# Altium schematic sheet Размеры платы.schdoc
size 420 x 297 mm; Author: ГН; Децимальный номер: СФ МЭИ ПЭ2-18 11.03.04. 3; Наименование. Строка 2: Плата печатная; Разработал: Гончаренко В.Ю.; Проверил: Смолин В.А.; Технический контроль: Рассказа Д.С.; Масштаб: 1:1; Лист. Номер: 1; Лист. Всего: 1
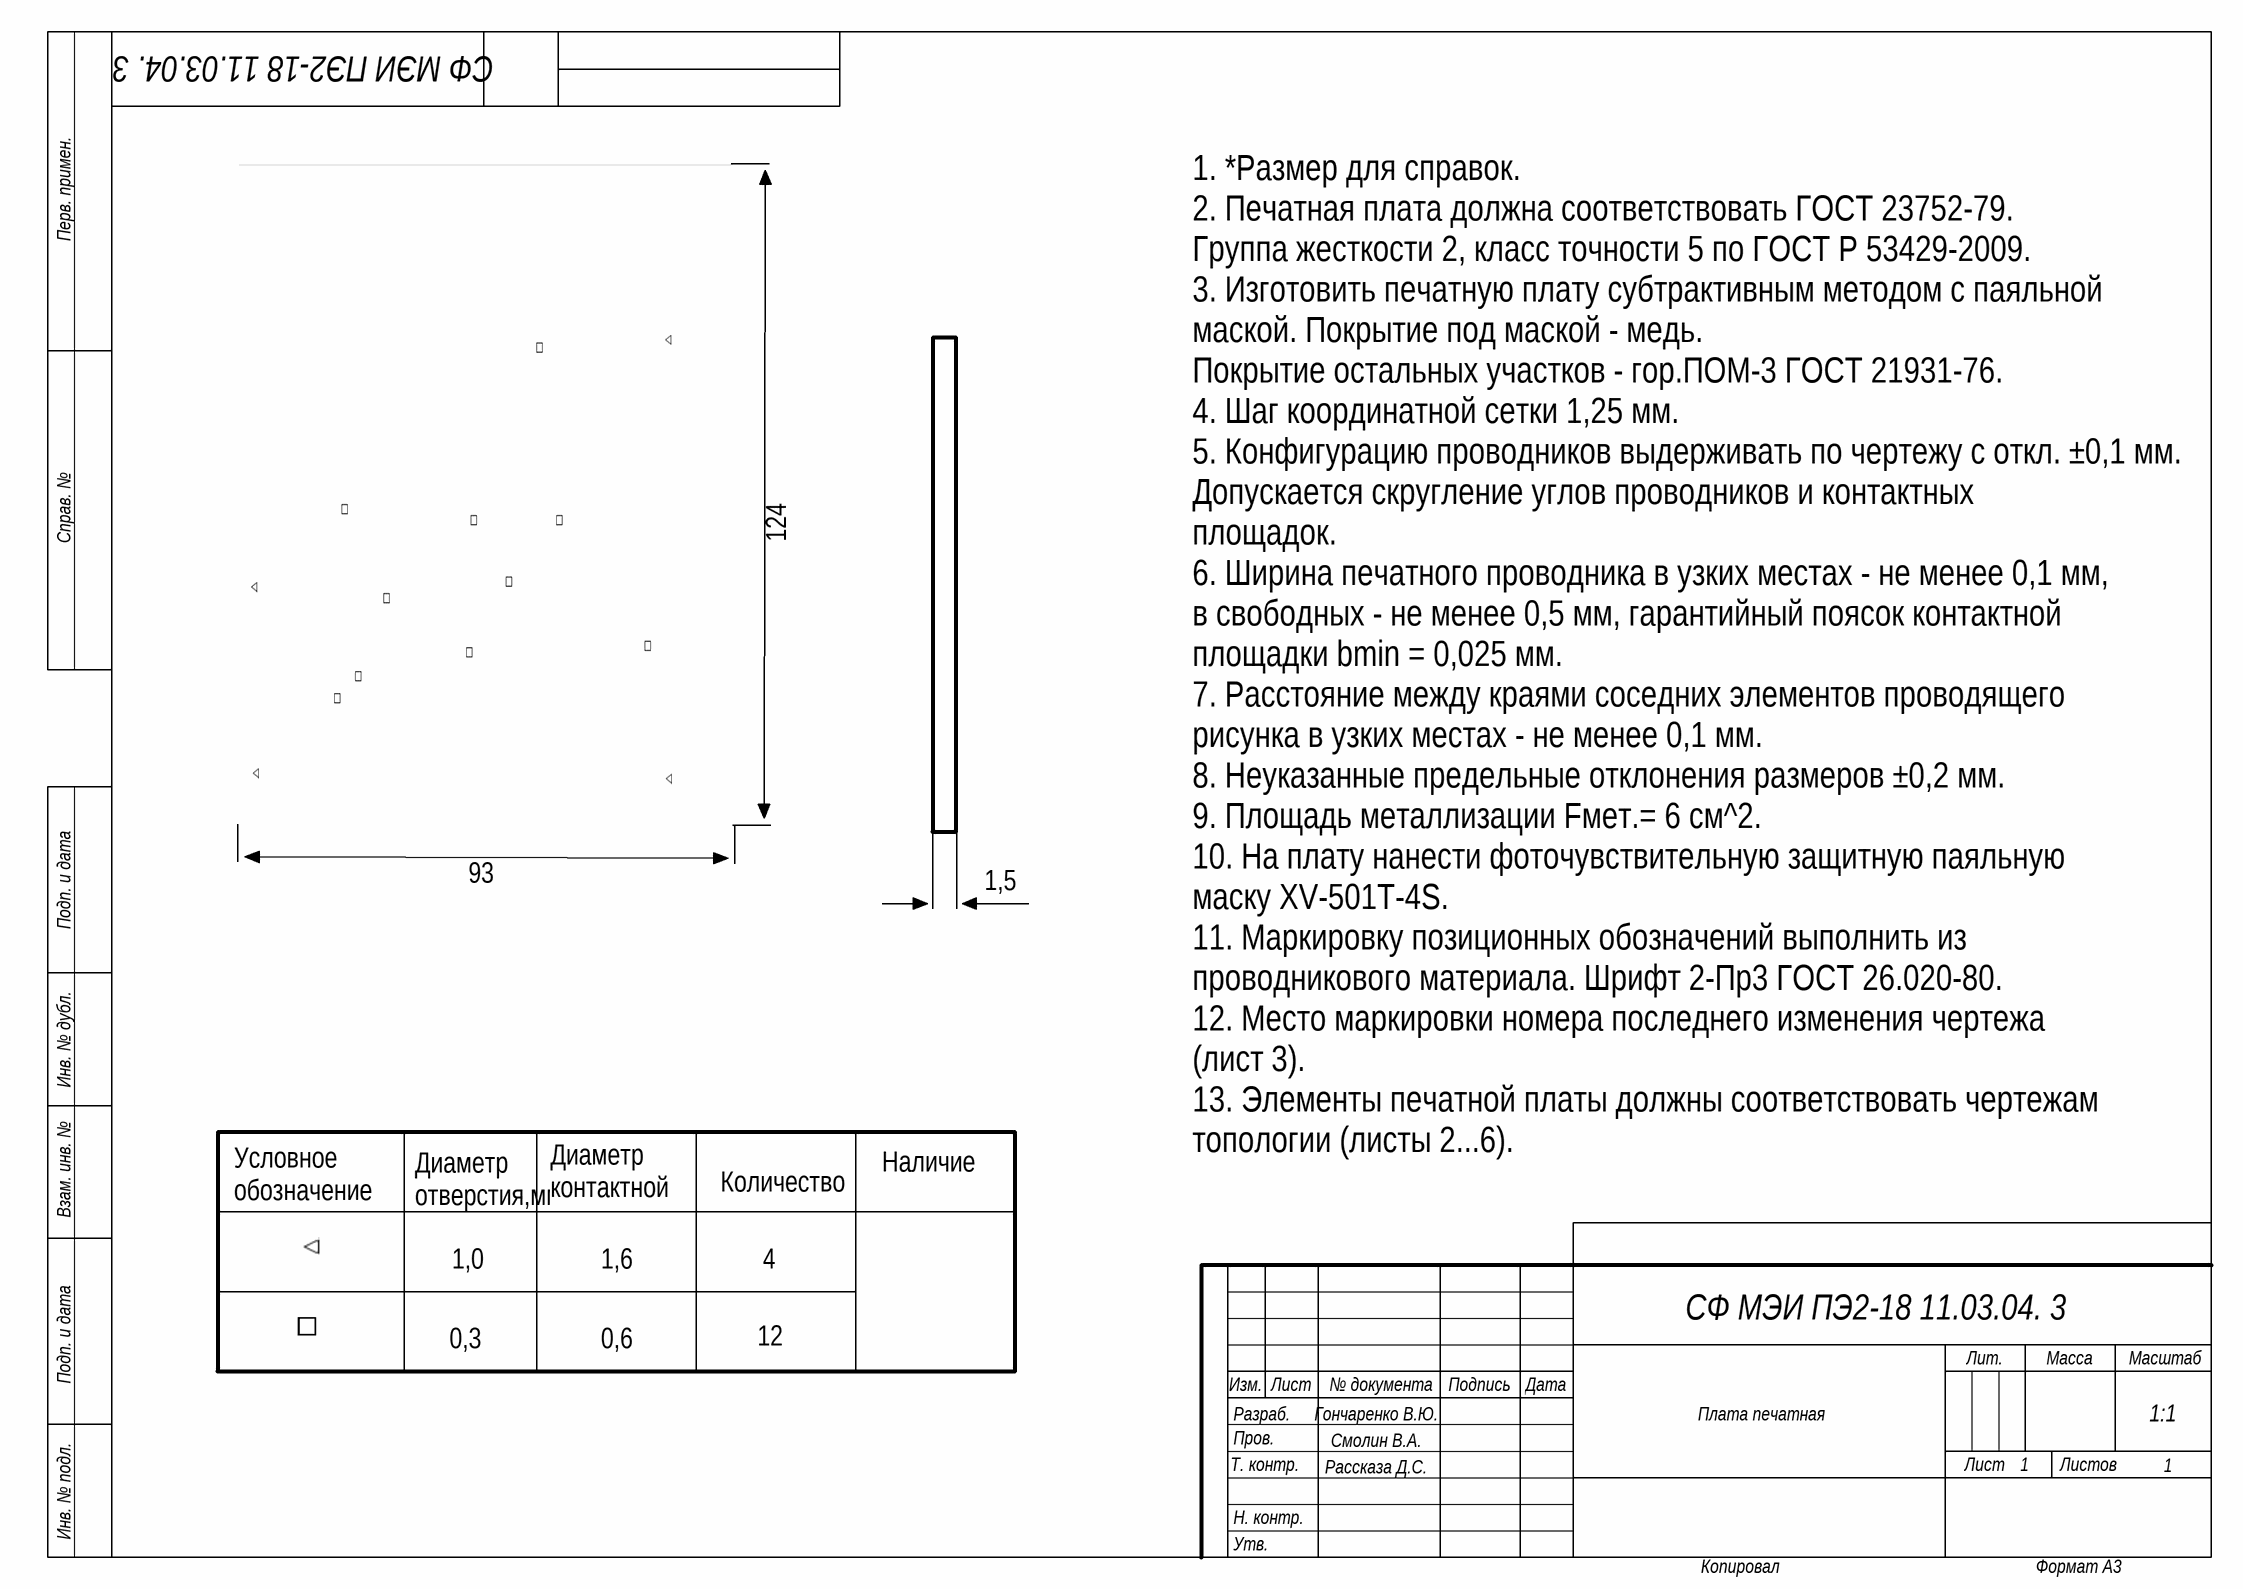
[diagram p0: Размеры платы.schdoc]

## Notes on the sheet
- 124
- 93
- 1,5
- Условное
  обозначение
  отверстия
- Диаметр
  отверстия,мм
- Диаметр
  контактной
  площадки,мм
- Количество
- Наличие
  металлизации
- 1. *Размер для справок.
  2. Печатная плата должна соответствовать ГОСТ 23752-79.
  Группа жесткости 2, класс точности 5 по ГОСТ Р 53429-2009.
  3. Изготовить печатную плату субтрактивным методом с паяльной
  маской. Покрытие под маской - медь.
  Покрытие остальных участков - гор.ПОМ-3 ГОСТ 21931-76.
  4. Шаг координатной сетки 1,25 мм.
  5. Конфигурацию проводников выдерживать по чертежу с откл. ±0,1 мм.
  Допускается скругление углов проводников и контактных
  площадок.
  6. Ширина печатного проводника в узких местах - не менее 0,1 мм,
  в свободных - не менее 0,5 мм, гарантийный поясок контактной
  площадки bmin = 0,025 мм.
  7. Расстояние между краями соседних элементов проводящего
  рисунка в узких местах - не менее 0,1 мм.
  8. Неуказанные предельные отклонения размеров ±0,2 мм.
  9. Площадь металлизации Fмет.= 6 см^2.
  10. На плату нанести фоточувствительную защитную паяльную
  маску XV-501T-4S.
  11. Маркировку позиционных обозначений выполнить из
  проводникового материала. Шрифт 2-Пр3 ГОСТ 26.020-80.
  12. Место маркировки номера последнего изменения чертежа
  (лист 3).
  13. Элементы печатной платы должны соответствовать чертежам
  топологии (листы 2...6).
- 1,0
- 1,6
- 4
- Есть
- 0,3
- 0,6
- 12
- Перв. примен.
- Справ. №
- Подп. и дата
- Инв. № дубл.
- Взам. инв. №
- Разраб.
- Изм.
- Лист
- № документа
- Подпись
- Дата
- Лит.
- Масса
- Масштаб
- Т. контр.
- Пров.
- Листов
- Инв. № подл.
- Н. контр.
- Утв.
- Копировал
- Формат A3